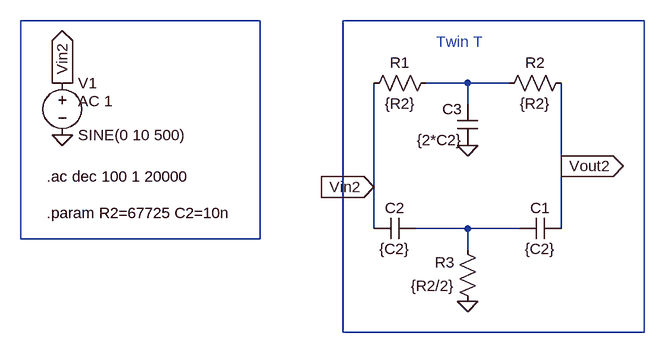
[diagram p0: schematic Twin_T.asc]
Twin_T.asc, the LTspice schematic file:
Version 4
SHEET 1 956 680
WIRE 96 -192 -272 -192
WIRE 688 -192 224 -192
WIRE 416 -96 352 -96
WIRE 480 -96 416 -96
WIRE 416 -64 416 -96
WIRE 560 32 560 -96
WIRE 272 64 272 -96
WIRE 272 128 272 64
WIRE 416 128 336 128
WIRE 496 128 416 128
WIRE 560 128 560 32
WIRE -272 144 -272 -192
WIRE 96 144 96 -192
WIRE 96 144 -272 144
WIRE 416 160 416 128
WIRE 224 288 224 -192
WIRE 688 288 688 -192
WIRE 688 288 224 288
FLAG 416 0 0
FLAG 416 240 0
FLAG 272 64 Vin2
IOPIN 272 64 In
FLAG 560 32 Vout2
IOPIN 560 32 Out
FLAG -208 -16 0
FLAG -208 -96 Vin2
IOPIN -208 -96 Out
SYMBOL res 368 -112 R90
WINDOW 0 0 56 VBottom 2
WINDOW 3 32 56 VTop 2
SYMATTR InstName R1
SYMATTR Value {R2}
SYMBOL res 576 -112 R90
WINDOW 0 0 56 VBottom 2
WINDOW 3 32 56 VTop 2
SYMATTR InstName R2
SYMATTR Value {R2}
SYMBOL res 432 256 R180
WINDOW 0 36 76 Left 2
WINDOW 3 36 40 Left 2
SYMATTR InstName R3
SYMATTR Value {R2/2}
SYMBOL cap 560 112 R90
WINDOW 0 0 32 VBottom 2
WINDOW 3 32 32 VTop 2
SYMATTR InstName C1
SYMATTR Value {C2}
SYMBOL cap 336 112 R90
WINDOW 0 0 32 VBottom 2
WINDOW 3 32 32 VTop 2
SYMATTR InstName C2
SYMATTR Value {C2}
SYMBOL cap 432 0 R180
WINDOW 0 24 56 Left 2
WINDOW 3 24 8 Left 2
SYMATTR InstName C3
SYMATTR Value {2*C2}
SYMBOL voltage -208 -112 R0
WINDOW 123 24 44 Left 2
WINDOW 39 0 0 Left 0
SYMATTR Value2 AC 1
SYMATTR InstName V1
SYMATTR Value SINE(0 10 500)
TEXT -232 104 Left 2 !.param R2=67725 C2=10n
TEXT -232 48 Left 2 !.ac dec 100 1 20000
TEXT 368 -160 Left 2 ;Twin T

The netlist it stands for:
* Twin_T.asc
R1 N003 Vin2 {R2}
R2 Vout2 N003 {R2}
R3 0 N004 {R2/2}
C1 Vout2 N004 {C2}
C2 N004 Vin2 {C2}
C3 0 N003 {2*C2}
V1 Vin2 0 SINE(0 10 500) AC 1
.param R2=67725 C2=10n
.ac dec 100 1 20000
* Twin T
.backanno
.end